# EasyEDA Pro project ProProject_无线温湿度检测系统1_2024-10-27.epro, schematic Schematic5
Create Date: 2023-11-22; Page Name: P1; Project Name: 无线温湿度检测系统1; Schematic Name: Schematic5; Update Date: 2024-02-18; Company: 嘉立创EDA; Page Size: A4; Version: V1.0
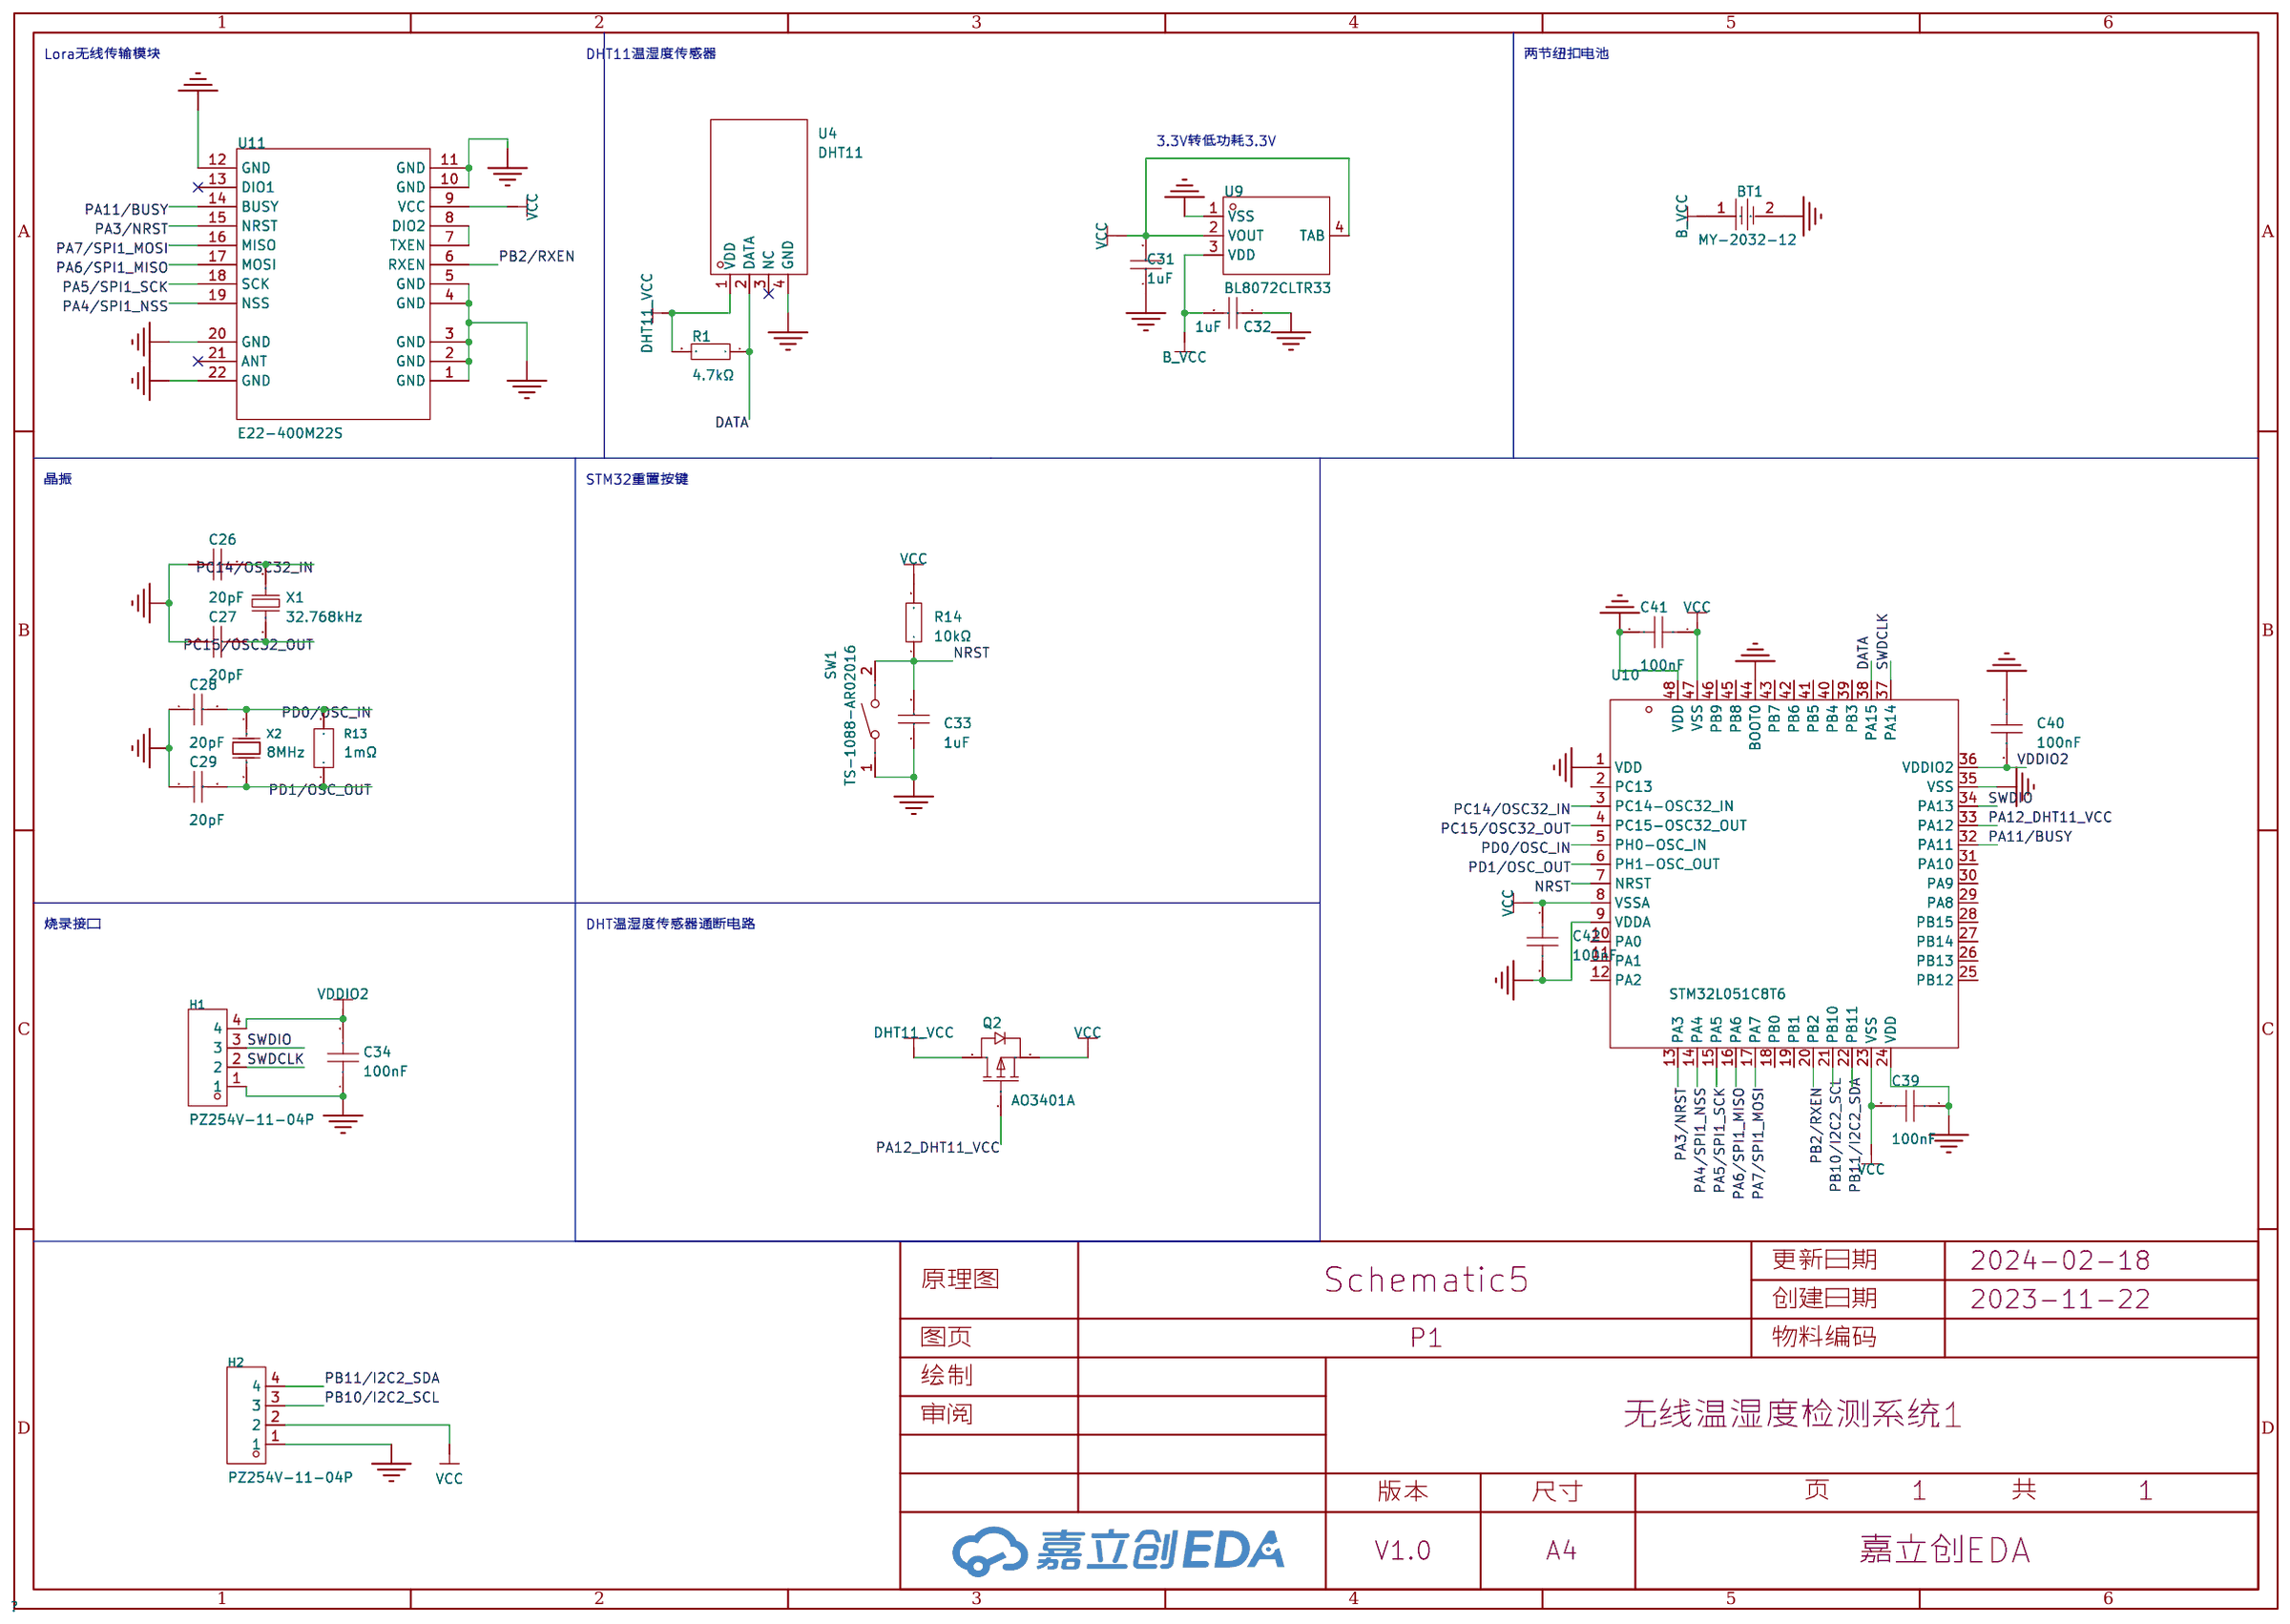
[diagram p1: schematic sheet]

## Parts
BT1  MY-2032-12  [BAT-SMD_MY-2032-12]
C26  20pF  [C0603]
C27  20pF  [C0603]
C28  20pF  [C0603]
C29  20pF  [C0603]
C31  1uF  [C0603]
C32  1uF  [C0603]
C33  1uF  [C0603]
C34  100nF  [C0603]
C39  100nF  [C0603]
C40  100nF  [C0603]
C41  100nF  [C0603]
C42  100nF  [C0603]
H1  PZ254V-11-04P  [HDR-TH_4P-P2.54-V-M]
H2  PZ254V-11-04P  [HDR-TH_4P-P2.54-V-M]
Q2  AO3401A  [SOT-23_L2.9-W1.3-P1.90-LS2.4-BR]
R1  4.7kΩ  [R0603]
R13  1mΩ  [R1206]
R14  10kΩ  [R0603]
SW1  TS-1088-AR02016  [SW-SMD_L3.9-W3.0-P4.45]
U4  DHT11  [SENSOR-TH_DHT11]
U9  BL8072CLTR33  [SOT-223-3_L6.5-W3.4-P2.30-LS7.0-BR]
U10  STM32L051C8T6  [LQFP-48_L7.0-W7.0-P0.50-LS9.0-BL]
U11  E22-400M22S  [WIRELM-SMD_E22-400M22S]
X1  32.768kHz  [FC-135R_L3.2-W1.5]
X2  8MHz  [CRYSTAL-SMD_L11.5-W4.8-LS12.7]

## Library data of the parts
BT1 = MY-2032-12: 连接器类型:电池扣;适用电池规格:CR2032;工作温度范围:-25℃~+85℃;; LCSC Part Name: 电池扣 适用电池:CR2032; Supplier Part: C964833; Manufacturer: MYOUNG(美阳); Supplier Footprint: SMD; JLCPCB Part Class: 扩展库; Datasheet: https://atta.szlcsc.com/upload/public/pdf/source/20201218/C964833_8D2DD5FC6B310B5B4EFEF4B683694189.pdf; Supplier: LCSC; Connector Type: 电池扣; Battery Type: CR2032; Operating Temperature Range: -25℃~+85℃
C26-C29 = CC0603JRNPO9BN200: 容值:20pF;精度:±5%;额定电压:50V;材质(温度系数):NP0;; LCSC Part Name: 20pF ±5% 50V; Supplier Part: C105621; Manufacturer: YAGEO(国巨); Supplier Footprint: 0603; JLCPCB Part Class: Extended Part; Datasheet: https://atta.szlcsc.com/upload/public/pdf/source/20170425/1493115771885.pdf; Supplier: LCSC; Tolerance: ±5%; Voltage Rated: 50V; Temperature Coefficient: NP0
C31-C33 = CL10A105KB8NNNC: 容值:1uF;精度:±10%;额定电压:50V;材质(温度系数):X5R;; LCSC Part Name: 1uF ±10% 50V; Supplier Part: C15849; Manufacturer: SAMSUNG(三星); Supplier Footprint: 0603; JLCPCB Part Class: Basic Part; Datasheet: https://atta.szlcsc.com/upload/public/pdf/source/20160103/1457707679084.pdf; Supplier: LCSC; Tolerance: ±10%; Voltage Rated: 50V; Temperature Coefficient: X5R
C34 C39-C42 = CC0603KRX7R9BB104: 容值:100nF;精度:±10%;额定电压:50V;材质(温度系数):X7R;; LCSC Part Name: 100nF ±10% 50V; Supplier Part: C14663; Manufacturer: YAGEO(国巨); Supplier Footprint: 0603; JLCPCB Part Class: Basic Part; Datasheet: https://atta.szlcsc.com/upload/public/pdf/source/20180910/C282072_33301C7F631E79921B82A8DAC6BCC5B3.pdf; Supplier: LCSC; Tolerance: ±10%; Voltage Rated: 50V; Temperature Coefficient: X7R
H1 H2 = PZ254V-11-04P: 排数:单排;总PIN位数:4P;间距:2.54mm;插针结构:1x4P;行距:-;安装类型:直插;圆针/方针:方针;额定电流:3A;额定电压:250V;配合针长度:6mm;塑高:2.5mm;端接针长度:3mm;触头材质:-;工作温度范围:-40℃~+105℃;颜色:黑色;; LCSC Part Name: 2.54mm 1x4P 直插 方针; Supplier Part: C2691448; Manufacturer: XFCN(兴飞); Supplier Footprint: 插件,P=2.54mm; JLCPCB Part Class: Extended Part; Datasheet: https://atta.szlcsc.com/upload/public/pdf/source/20200309/C492403_F9F19131791D08044AD4F84F8E751A34.pdf; Supplier: LCSC; Number of Rows: 单排; Number of Pins: 4P; Pitch: 2.54mm; Pin Structure: 1x4P; Mounting Type: 直插; Circluar Pins/Square Pins: 方针; Current Rating (Max): 3A; Voltage Rating (Max): 250V; Length of Mating Pin: 6mm; Insulation Height: 2.5mm; Length of End Connection Pin: 3mm; Operating Temperature Range: -40℃~+105℃; Color: 黑色
Q2 = AO3401A_C15127: 类型:P沟道;漏源电压(Vdss):30V;连续漏极电流(Id):4A;功率(Pd):1.4W;导通电阻(RDS(on)@Vgs,Id):44mΩ@10V,4.3A;; LCSC Part Name: P沟道 30V 4A; Supplier Part: C15127; Manufacturer: AOS; Supplier Footprint: SOT-23-3L; JLCPCB Part Class: 基础库; Datasheet: https://atta.szlcsc.com/upload/public/pdf/source/20160507/1462613609053.pdf; Supplier: LCSC; Type: P沟道; Drain Source Voltage (Vdss): 30V; Continuous Drain Current (Id): 4A; Power Dissipation (Pd): 1.4W; Drain Source On Resistance (RDS(on)@Vgs,Id): 44mΩ@10V,4.3A; Gate Threshold Voltage (Vgs(th)@Id): 1.3V@250uA
R1 = 0603WAF4701T5E: 电阻类型:厚膜电阻;阻值:4.7kΩ;精度:±1%;功率:100mW;温度系数:±100ppm/℃;; LCSC Part Name: 厚膜电阻 4.7kΩ ±1% 100mW; Supplier Part: C23162; Manufacturer: UNI-ROYAL(厚声); Supplier Footprint: 0603; JLCPCB Part Class: 基础库; Datasheet: https://atta.szlcsc.com/upload/public/pdf/source/20200306/C422600_1E6D84923E4A46A82E41ADD87F860B5C.pdf; Supplier: LCSC; Type: 厚膜电阻; Tolerance: ±1%; Power(Watts): 100mW; Temperature Coefficient: ±100ppm/℃; Overload Voltage (Max): 75V; Operating Temperature Range: -55℃~+155℃
R13 = PA1206FRF470R001L: 阻值:1mΩ;精度:±1%;功率:1W;温度系数:±100ppm/℃;; LCSC Part Name: 1mΩ ±1% 1W; Supplier Part: C728283; Manufacturer: YAGEO(国巨); Supplier Footprint: 1206; JLCPCB Part Class: Extended Part; Datasheet: https://atta.szlcsc.com/upload/public/pdf/source/20201130/C728283_855FA66FAF64914AE12930520DBED2DB.pdf; Supplier: LCSC; Tolerance: ±1%; Power(Watts): 1W; Temperature Coefficient: ±100ppm/℃; Operating Temperature Range: -55℃~+170℃
R14 = 0603WAF1002T5E: 电阻类型:厚膜电阻;阻值:10kΩ;精度:±1%;功率:100mW;; LCSC Part Name: 厚膜电阻 10kΩ ±1% 100mW; Supplier Part: C25804; Manufacturer: UNI-ROYAL(厚声); Supplier Footprint: 0603; JLCPCB Part Class: 基础库; Datasheet: https://atta.szlcsc.com/upload/public/pdf/source/20200306/C422600_1E6D84923E4A46A82E41ADD87F860B5C.pdf; Supplier: LCSC; Type: 厚膜电阻; Tolerance: ±1%; Power(Watts): 100mW; Temperature Coefficient: ±100ppm/℃; Overload Voltage (Max): 75V; Operating Temperature Range: -55℃~+155℃
SW1 = TS-1088-AR02016: 触点电流:50mA;额定电压(DC):12V;绝缘电阻:100MΩ;电路结构:单刀单掷;安装方式:立贴;作用力:160gf@±50gf;机械寿命:10万次;带支架:否;; LCSC Part Name: 4*3*2mm 立贴 轻触开关; Supplier Part: C720477; Manufacturer: XUNPU(讯普); Supplier Footprint: SMD; JLCPCB Part Class: Extended Part; Datasheet: https://atta.szlcsc.com/upload/public/pdf/source/20200810/C720475_60D09DD6C54279ADDB2DC25100F1CC11.pdf; Supplier: LCSC; Contact Current: 50mA; Voltage Rating (DC): 12V; Insulation Resistance: 100MΩ; Circuit: 单刀单掷; Mounting Style: 立贴; Actuator Style: 圆形按钮; Actuator/Cap Color: 黑色; Operating Force: 160gf@±50gf; Mechanical Life: 10万次; Operating Temperature: -30℃~+80℃; Pin Style: SMD接片; Switch Length: 4mm; Switch Width: 3mm; Switch Height: 2mm; Strike Gundam: 否
U4 = DHT11: 新款电容式数字温湿度传感器,老款已停产16.1x12.6x5.8mm; LCSC Part Name: DHT11  电容式传感器; Supplier Part: C117051; Manufacturer: 广州奥松; Supplier Footprint: SIP-4; JLCPCB Part Class: 扩展库; Datasheet: https://atta.szlcsc.com/upload/public/pdf/source/20170703/1499081238365.pdf; Supplier: LCSC
U9 = BL8072CLTR33: 输出类型:-;; Supplier Part: C843780; Manufacturer: BL(上海贝岭); Supplier Footprint: SOT-223-3; JLCPCB Part Class: 扩展库; Datasheet: https://atta.szlcsc.com/upload/public/pdf/source/20180502/C213389_E4FB2003AA9C296B29EE3B9725BCD4A5.pdf; Supplier: LCSC
U10 = STM32L051C8T6: CPU内核:ARM Cortex-M0;CPU最大主频:32MHz;工作电压范围:1.65V~3.6V;内部振荡器:有;程序 FLASH容量:64K@x8bit;RAM总容量:8KB;EEPROM/数据 FLASH容量:2KB;GPIO端口数量:37;ADC(单元数/通道数/位数):1@x10ch/12bit;外设/功能/协议栈:DMA；PWM；看门狗;工作温度范围:-40℃~+85℃;; LCSC Part Name: ARM Cortex-M0 32MHz 闪存：64K@x8bit RAM：8KB; Supplier Part: C110878; Manufacturer: ST(意法半导体); Supplier Footprint: LQFP-48(7x7); JLCPCB Part Class: 扩展库; Datasheet: https://atta.szlcsc.com/upload/public/pdf/source/20170523/1495533904231.pdf; Supplier: LCSC; CPU Core: ARM Cortex-M0; Maximum Frequency: 32MHz; Supply Voltage Range: 1.65V~3.6V; Internal Oscillator: 有; Program FLASH Size: 64K@x8bit; RAM Size: 8KB; EEPROM/Data FLASH Size: 2KB; GPIO Ports Number: 37; ADC (Units/Channels/bits): 1@x10ch/12bit; Peripherals / Functions / Protocol Stacks: DMA；PWM；看门狗; Operating Temperature Range: -40℃~+85℃
U11 = E22-400M22S: SX1262|SX1268+PA新一代LoRa扩频433MHz/470M无线模块SX1278升级; Supplier Part: C411291; Manufacturer: EBYTE(亿佰特); Supplier Footprint: SMD,14.0x20mm; JLCPCB Part Class: 扩展库; Datasheet: https://atta.szlcsc.com/upload/public/pdf/source/20190812/C411291_90FD46F52AC63064ACAA22A31BCCA1DF.pdf; Supplier: LCSC
X1 = Q13FC1350000400: 频率:32.768kHz;频率公差:±20ppm;负载电容:12.5pF;; LCSC Part Name: 32.768kHz ±20ppm 12.5pF; Supplier Part: C32346; Manufacturer: EPSON(爱普生); Supplier Footprint: SMD3215-2P; JLCPCB Part Class: Basic Part; Datasheet: https://atta.szlcsc.com/upload/public/pdf/source/20190108/C32346_746D6B07EAF90824457A96480007685F.pdf; Supplier: LCSC; Crystal Type: 贴片无源晶振; Frequency Tolerance: ±20ppm; Load Capacitance: 12.5pF; Equivalent Series Resistance (ESR): 70kΩ; Operating Temperature: -40℃~+85℃
X2 = X49SM8MSD2SC: 频率:8MHz;频率公差:±20ppm;负载电容:20pF;; LCSC Part Name: 8MHz ±20ppm 20pF HC-49SMD; Supplier Part: C12674; Manufacturer: YXC(扬兴晶振); Supplier Footprint: HC-49S-SMD; JLCPCB Part Class: Basic Part; Datasheet: https://atta.szlcsc.com/upload/public/pdf/source/20210329/C106809_0E91E60850A780B284B63D653DC40EA4.pdf; Supplier: LCSC; Crystal Type: 49SMD; Frequency Tolerance: ±20ppm; Frequency Stability: ±30ppm; Load Capacitance: 20pF; Operating Temperature: -20℃~+70℃

## Nets
GND: BT1.2 C26.1 C27.1 C28.1 C29.1 C31.1 C32.1 C33.1 C34.1 C39.1 C40.1 C41.2 C42.2 H1.1 H2.1 SW1.1 U4.4(GND) U9.1(VSS) U10.1(VDD) U10.9(VDDA) U10.24(VDD) U10.35(VSS) U10.44(BOOT0) U10.48(VDD) U11.1(GND) U11.2(GND) U11.3(GND) U11.4(GND) U11.5(GND) U11.10(GND) U11.11(GND) U11.12(GND) U11.20(GND) U11.22(GND)
VCC: C31.2 C39.2 C41.1 C42.1 H2.2 Q2.2(S) R14.2 U9.2(VOUT) U9.4(TAB) U10.8(VSSA) U10.23(VSS) U10.47(VSS) U11.9(VCC)
VDDIO2: C34.2 C40.2 H1.4 U10.36(VDDIO2)
B_VCC: BT1.1 C32.2 U9.3(VDD)
DATA: R1.1 U4.2(DATA) U10.38(PA15)
DHT11_VCC: Q2.3(D) R1.2 U4.1(VDD)
NRST: C33.2 R14.1 SW1.2 U10.7(NRST)
PA3/NRST: U10.13(PA3) U11.15(NRST)
PA4/SPI1_NSS: U10.14(PA4) U11.19(NSS)
PA5/SPI1_SCK: U10.15(PA5) U11.18(SCK)
PA6/SPI1_MISO: U10.16(PA6) U11.17(MOSI)
PA7/SPI1_MOSI: U10.17(PA7) U11.16(MISO)
PA11/BUSY: U10.32(PA11) U11.14(BUSY)
PA12_DHT11_VCC: Q2.1(G) U10.33(PA12)
PB2/RXEN: U10.20(PB2) U11.6(RXEN)
PB10/I2C2_SCL: H2.3 U10.21(PB10)
PB11/I2C2_SDA: H2.4 U10.22(PB11)
PC14/OSC32_IN: C26.2 U10.3(PC14-OSC32_IN) X1.2
PC15/OSC32_OUT: C27.2 U10.4(PC15-OSC32_OUT) X1.1
PD0/OSC_IN: C28.2 R13.2 U10.5(PH0-OSC_IN) X2.1(OSC1)
PD1/OSC_OUT: C29.2 R13.1 U10.6(PH1-OSC_OUT) X2.2(OSC2)
SWDCLK: H1.2 U10.37(PA14)
SWDIO: H1.3 U10.34(PA13)
$1N9638: U11.7(TXEN) U11.8(DIO2)

Not connected (* = marked no-connect by the designer): U4 3(NC)*; U10 2(PC13) 10(PA0) 11(PA1) 12(PA2) 18(PB0) 19(PB1) 25(PB12) 26(PB13) 27(PB14) 28(PB15) 29(PA8) 30(PA9) 31(PA10) 39(PB3) 40(PB4) 41(PB5) 42(PB6) 43(PB7) 45(PB8) 46(PB9); U11 13(DIO1)* 21(ANT)*

## Notes on the sheet
- Lora无线传输模块
- DHT11温湿度传感器
- 两节纽扣电池
- 3.3V转低功耗3.3V
- 晶振
- STM32重置按键
- 烧录接口
- DHT温湿度传感器通断电路
